# EAGLE design KMO_IO_MV6 (EAGLE 9.1.3)

## Sheet 1 of 2
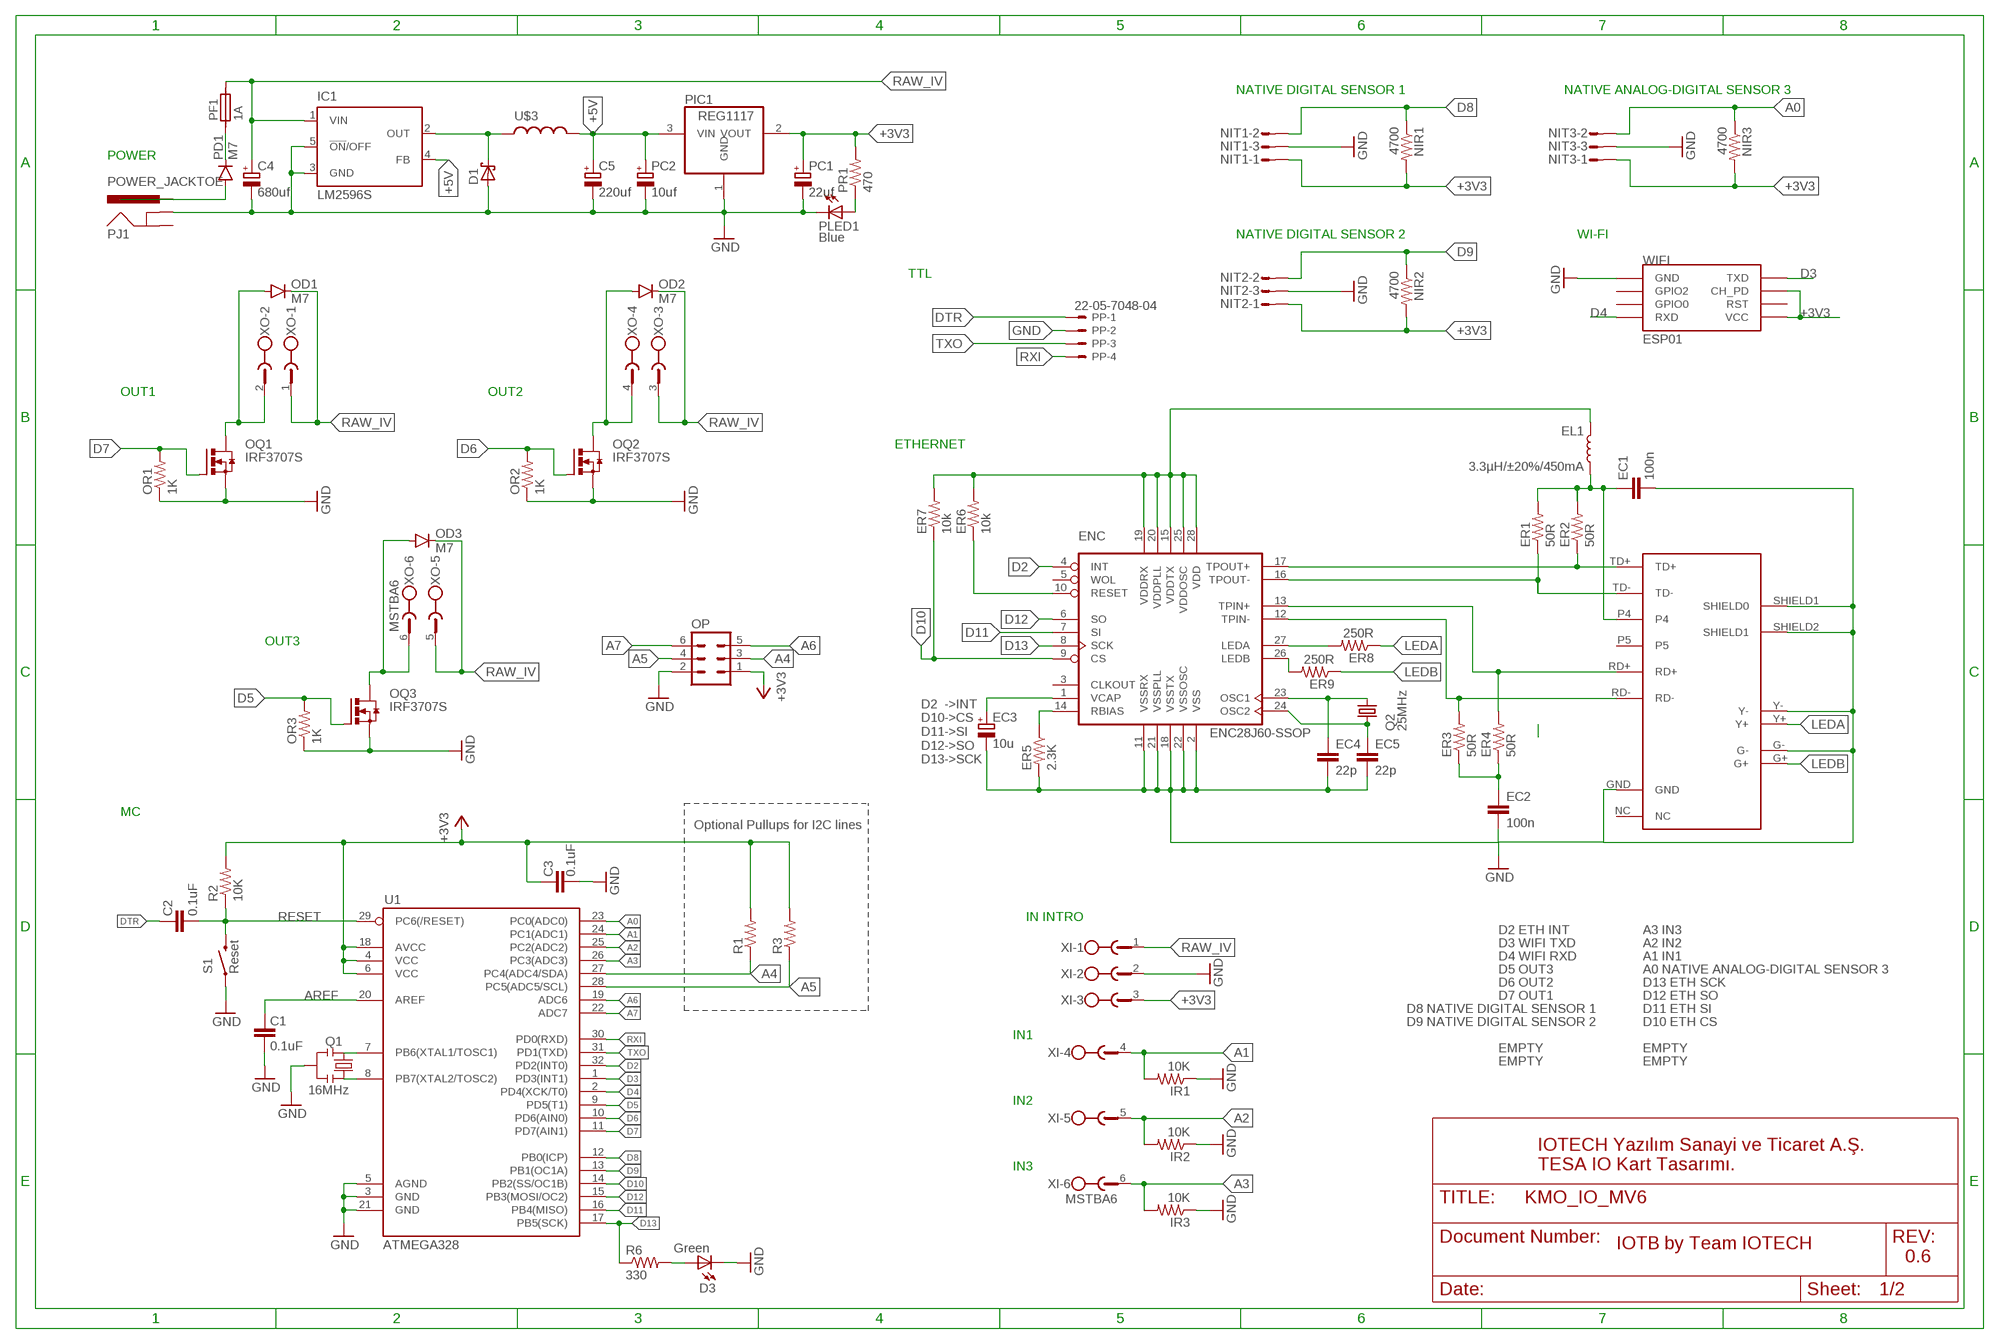
[diagram p0: schematic, sheet 1]

### Parts
C1  0.1uF  CAP0805  [0805]
C2  0.1uF  CAP0805  [0805]
C3  0.1uF  CAP0805  [0805]
C4  680uf  CPOL-EU140CLH-1010  [140CLH-1010]
C5  220uf  CPOL-EU140CLH-1010  [140CLH-1010]
D1  SCHOTTKY-DIODESMD  [SMB]
D3  Green  LEDCHIP-LED0805  [CHIP-LED0805]
EC1  100n  CAP0805  [0805]
EC2  100n  CAP0805  [0805]
EC3  10u  CPOL-EUCT3216  [CT3216]
EC4  22p  CAP0805  [0805]
EC5  22p  CAP0805  [0805]
EL1  3.3µH/±20%/450mA  INDUCTOR-0805-3.3UH  [0805]
ENC  ENC28J60-SSOP  [SSOP28]
ER1  50R  RESISTOR0805-RES  [0805]
ER2  50R  RESISTOR0805-RES  [0805]
ER3  50R  RESISTOR0805-RES  [0805]
ER4  50R  RESISTOR0805-RES  [0805]
ER5  2.3K  RESISTOR0805-RES  [0805]
ER6  10k  RESISTOR0805-RES  [0805]
ER7  10k  RESISTOR0805-RES  [0805]
ER8  250R  RESISTOR0805-RES  [0805]
ER9  250R  RESISTOR0805-RES  [0805]
IC1  LM2596S  [TO263-5]
IR1  10K  RESISTOR0805-RES  [0805]
IR2  10K  RESISTOR0805-RES  [0805]
IR3  10K  RESISTOR0805-RES  [0805]
NIR1  4700  RESISTOR0805-RES  [0805]
NIR2  4700  RESISTOR0805-RES  [0805]
NIR3  4700  RESISTOR0805-RES  [0805]
NIT1  S03P  [S03P]
NIT2  S03P  [S03P]
NIT3  S03P  [S03P]
OD1  M7  DIODESMA  [SMA-DIODE]
OD2  M7  DIODESMA  [SMA-DIODE]
OD3  M7  DIODESMA  [SMA-DIODE]
OP  MA03-2  [MA03-2]
OQ1  IRF3707S  IRF3704S  [D2PACK]
OQ2  IRF3707S  IRF3704S  [D2PACK]
OQ3  IRF3707S  IRF3704S  [D2PACK]
OR1  1K  RESISTOR0805-RES  [0805]
OR2  1K  RESISTOR0805-RES  [0805]
OR3  1K  RESISTOR0805-RES  [0805]
PC1  22uf  CPOL-EUCT3216  [CT3216]
PC2  10uf  CPOL-EUCT3216  [CT3216]
PD1  M7  DIODESMA  [SMA-DIODE]
PF1  1A  SIBA194600  [1820]
PIC1  REG1117  [SOT223]
PJ1  POWER_JACKTOE  [POWER_JACK_SMD_OVERPASTE_TOE]
PLED1  Blue  LEDCHIP-LED0805  [CHIP-LED0805]
PP  22-05-7048-04  [7395-04]
PR1  470  RESISTOR0805-RES  [0805]
Q1  16MHz  RESONATOR1:1  [RESONATOR-SMD-1:1]
Q2  25MHz  KX-9B  [5.0X3.2_2]
R1  RESISTOR0805-RES  [0805]
R2  10K  RESISTOR0805-RES  [0805]
R3  RESISTOR0805-RES  [0805]
R6  330  RESISTOR0805-RES  [0805]
S1  Reset  SWITCH-MOMENTARY-2SMD-ALT01  [TACTILE-SWITCH-SMD-ALT01]
U1  ATMEGA328  ATMEGA168  [TQFP32-08]
U$2  HR911105A  [RJ45]
U$3  MSS1260  [MSS1260]
WIFI  ESP01  [ESP01]
XI  MSTBA6  [MSTBA6]
XO  MSTBA6  [MSTBA6]

### Nets
+3V3: C3.2 EL1.1 ENC.15(VDDTX) ENC.19(VDDRX) ENC.20(VDDPLL) ENC.25(VDDOSC) ENC.28(VDD) ER6.2 ER7.2 NIR1.2 NIR2.2 NIR3.2 NIT1.1 NIT2.1 NIT3.1 OP.1 PC1.+ PIC1.2(VOUT) PR1.2 R1.2 R2.2 R3.2 U1.4(VCC) U1.6(VCC) U1.18(AVCC) WIFI.CH_PD WIFI.VCC XI.3
+5V: C5.+ IC1.4(FB) PC2.+ PIC1.3(VIN) U$3.P$1
A0: NIR3.1 NIT3.2 U1.23(PC0(ADC0))
A1: IR1.2 U1.24(PC1(ADC1)) XI.4
A2: IR2.2 U1.25(PC2(ADC2)) XI.5
A3: IR3.2 U1.26(PC3(ADC3)) XI.6
A4: OP.3 R1.1 U1.27(PC4(ADC4/SDA))
A5: OP.4 R3.1 U1.28(PC5(ADC5/SCL))
A6: OP.5 U1.19(ADC6)
A7: OP.6 U1.22(ADC7)
AREF: C1.2 U1.20(AREF)
D2: ENC.4(INT) U1.32(PD2(INT0))
D3: U1.1(PD3(INT1)) WIFI.TX(TXD)
D4: U1.2(PD4(XCK/T0)) WIFI.RX(RXD)
D5: OQ3.1(G) OR3.2 U1.9(PD5(T1))
D6: OQ2.1(G) OR2.2 U1.10(PD6(AIN0))
D7: OQ1.1(G) OR1.2 U1.11(PD7(AIN1))
D8: NIR1.1 NIT1.2 U1.12(PB0(ICP))
D9: NIR2.1 NIT2.2 U1.13(PB1(OC1A))
D10: ENC.9(CS) ER7.1 U1.14(PB2(SS/OC1B))
D11: ENC.7(SI) U1.16(PB4(MISO))
D12: ENC.6(SO) U1.15(PB3(MOSI/OC2))
D13: ENC.8(SCK) R6.1 U1.17(PB5(SCK))
DTR: C2.2 PP.1
EP4: EC1.1 EL1.2 ER1.2 ER2.2 U$2.P4
GND: C1.1 C3.1 C4.- C5.- D1.A D3.C EC1.2 EC2.2 EC3.- EC4.2 EC5.2 ENC.2(VSS) ENC.11(VSSRX) ENC.18(VSSTX) ENC.21(VSSPLL) ENC.22(VSSOSC) ER5.2 IC1.3(GND) IC1.5(!ON!/OFF) IR1.1 IR2.1 IR3.1 NIT1.3 NIT2.3 NIT3.3 OP.2 OQ1.3(S) OQ2.3(S) OQ3.3(S) OR1.1 OR2.1 OR3.1 PC1.- PC2.- PIC1.1(GND) PJ1.GND(GNDBREAK) PLED1.C PP.2 Q1.2 S1.1 S1.2 U1.3(GND) U1.5(AGND) U1.21(GND) U$2.G- U$2.GND U$2.SHIELD1(SHIELD0) U$2.SHIELD2(SHIELD1) U$2.Y- WIFI.GND XI.2
LEDA: ER8.1 U$2.Y+
LEDB: ER9.1 U$2.G+
N$1: OD3.A OQ3.2(D) XO.6
N$2: PD1.C PF1.1
N$3: OD1.A OQ1.2(D) XO.2
N$4: OD2.A OQ2.2(D) XO.4
N$5: D3.A R6.2
N$6: EC2.1 ER3.1 ER4.1
N$9: ENC.27(LEDA) ER8.2
N$10: Q1.3 U1.8(PB7(XTAL2/TOSC2))
N$11: PLED1.A PR1.1
N$13: EC3.+ ENC.1(VCAP)
N$14: ENC.26(LEDB) ER9.2
N$15: Q1.1 U1.7(PB6(XTAL1/TOSC1))
N$16: D1.C IC1.2(OUT) U$3.P$2
N$17: ENC.10(RESET) ER6.1
N$18: PD1.A PJ1.VIN0(PWR)
N$19: ENC.14(RBIAS) ER5.1
N$22: EC5.1 ENC.24(OSC2) Q2.1
N$24: EC4.1 ENC.23(OSC1) Q2.2
RAW_IV [vcc]: C4.+ IC1.1(VIN) OD1.C OD2.C OD3.C PF1.2 XI.1 XO.1 XO.3 XO.5
RD+: ENC.13(TPIN+) ER4.2 U$2.RD+
RD-: ENC.12(TPIN-) ER3.2 U$2.RD-
RESET: C2.1 R2.1 S1.3 S1.4 U1.29(PC6(/RESET))
RXI: PP.4 U1.30(PD0(RXD))
TD+: ENC.17(TPOUT+) ER2.1 U$2.TD+
TD-: ENC.16(TPOUT-) ER1.1 U$2.TD-
TXO: PP.3 U1.31(PD1(TXD))
Unconnected: ENC.3(CLKOUT) ENC.5(WOL) PJ1.P$4(GND) U$2.NC U$2.P5 WIFI.GPIO0 WIFI.GPIO2 WIFI.RST

### Notes on the sheet
- NATIVE DIGITAL SENSOR 1 | NATIVE ANALOG-DIGITAL SENSOR 3
- POWER
- NATIVE DIGITAL SENSOR 2 | WI-FI
- TTL
- OUT1 | OUT2
- ETHERNET
- OUT3
- D2  ->INT
  D10->CS
  D11->SI
  D12->SO
  D13->SCK
- MC
- Optional Pullups for I2C lines
- IN INTRO
- D2 ETH INT | A3 IN3
- D3 WIFI TXD | A2 IN2
- D4 WIFI RXD | A1 IN1
- D5 OUT3 | A0 NATIVE ANALOG-DIGITAL SENSOR 3
- D6 OUT2 | D13 ETH SCK
- D7 OUT1 | D12 ETH SO
- D8 NATIVE DIGITAL SENSOR 1 | D11 ETH SI
- D9 NATIVE DIGITAL SENSOR 2 | D10 ETH CS
- IN1
- EMPTY | EMPTY
- EMPTY | EMPTY
- IN2
- IN3
- IOTECH Yazılım Sanayi ve Ticaret A.Ş.
  TESA IO Kart Tasarımı.
- IOTB by Team IOTECH
- 0.6

## Sheet 2 of 2
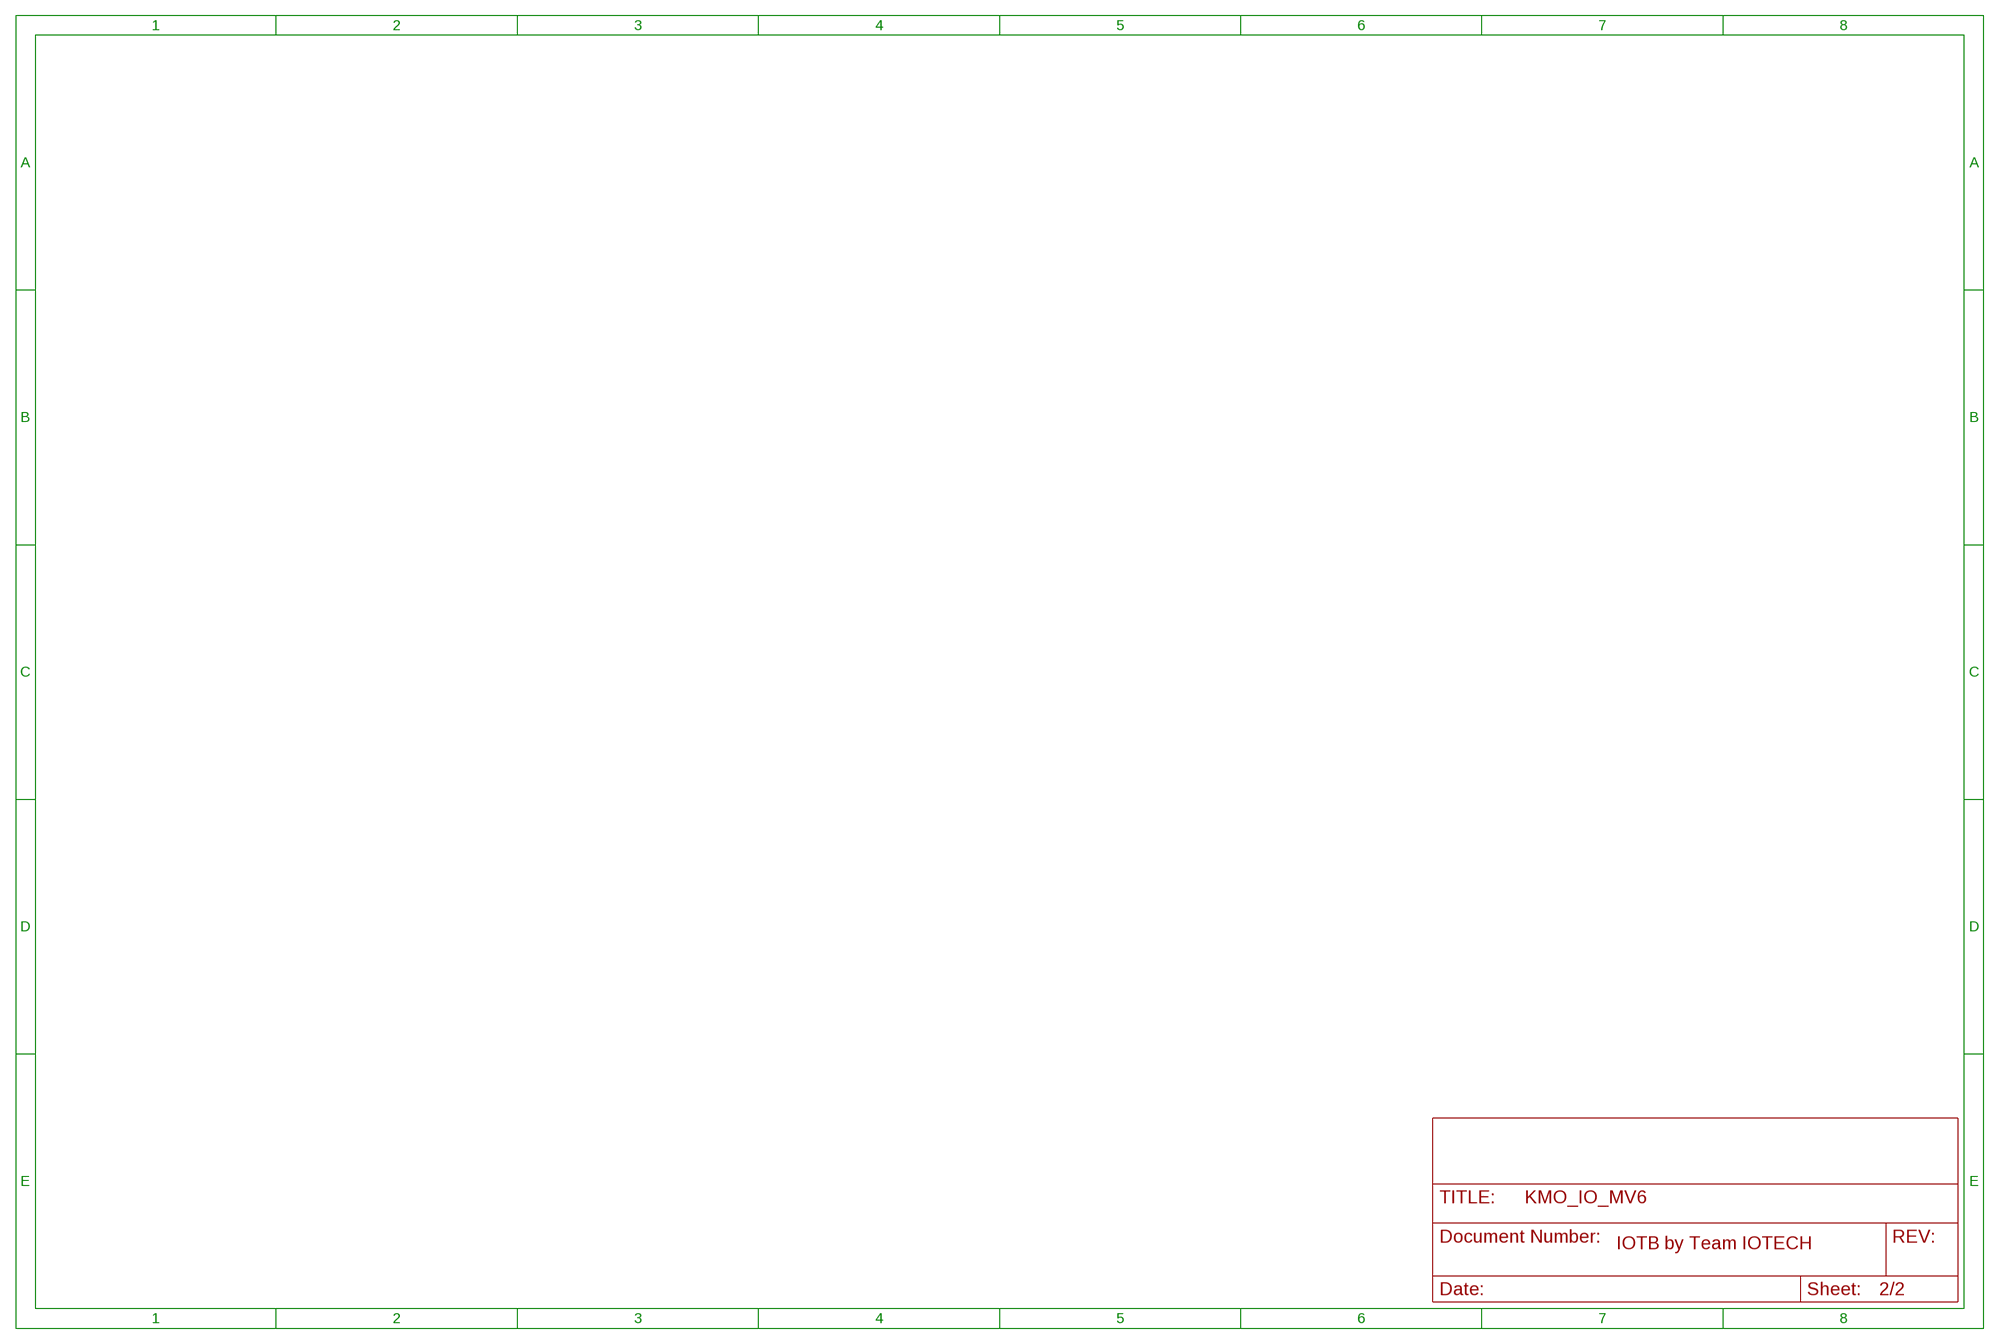
[diagram p1: schematic, sheet 2]

### Notes on the sheet
- IOTB by Team IOTECH

## Library data of the parts
C1-C3 EC1 EC2 EC4 EC5 = SparkFun-Passives:CAP: Capacitor Standard 0603 ceramic capacitor, and 0.1" leaded capacitor.
C4 C5 EC3 PC1 PC2 = rcl:CPOL-EU: POLARIZED CAPACITOR, European symbol; SPICEPREFIX: C
D1 = diode:SCHOTTKY-DIODE: Schottky Diode
D3 PLED1 = led:LED: LED OSRAM: - CHIPLED LG R971, LG N971, LY N971, LG Q971, LY Q971, LO R971, LY R971 LH N974, LH R974 LS Q976, LO Q976, LY Q976 LO Q996 - Hyper CHIPLED LW Q18S LB Q993, LB Q99A, LB R99A - SideLED LS A670, LO A670, LY A670, LG A670, LP A670 LB A673, LV A673, LT A673, LW A673 LH A674 LY A675 LS A676, LA A676, LO A676, LY A676, LW A676 LS A679, LY A679, LG A679 - Hyper Micro SIDELED® LS Y876, LA Y876, LO Y876, LY Y876 LT Y87S - SmartLED LW L88C, LW L88S LB L89C, LB L89S, LG L890 LS L89K, LO L89K, LY L89K LS L896, LA L896, LO L896, LY L896 - TOPLED LS T670, LO T670, LY T670, LG T670, LP T670 LSG T670, LSP T670, LSY T670, LOP T670, LYG T670 LG T671, LOG T671, LSG T671 LB T673, LV T673, LT T673, LW T673 LH T674 LS T676, LA T676, LO T676, LY T676, LB T676, LH T676, LSB T676, LW T676 LB T67C, LV T67C, LT T67C, LS T67K, LO T67K, LY T67K, LW E67C LS E67B, LA E67B, LO E67B, LY E67B, LB E67C, LV E67C, LT E67C LW T67C LS T679, LY T679, LG T679 LS T770, LO T770, LY T770, LG T770, LP T770 LB T773, LV T773, LT T773, LW T773 LH T774 LS E675, LA E675, LY E675, LS T675 LS T776, LA T776, LO T776, LY T776, LB T776 LHGB T686 LT T68C, LB T68C - Hyper Mini TOPLED® LB M676 - Mini TOPLED Santana® LG M470 LS M47K, LO M47K, LY M47K Source: http://www.osram.convergy.de LUXEON: - LUMILED® LXK2-PW12-R00, LXK2-PW12-S00, LXK2-PW14-U00, LXK2-PW14-V00 LXK2-PM12-R00, LXK2-PM12-S00, LXK2-PM14-U00 LXK2-PE12-Q00, LXK2-PE12-R00, LXK2-PE12-S00, LXK2-PE14-T00, LXK2-PE14-U00 LXK2-PB12-K00, LXK2-PB12-L00, LXK2-PB12-M00, LXK2-PB14-N00, LXK2-PB14-P00, LXK2-PB14-Q00 LXK2-PR12-L00, LXK2-PR12-M00, LXK2-PR14-Q00, LXK2-PR14-R00 LXK2-PD12-Q00, LXK2-PD12-R00, LXK2-PD12-S00 LXK2-PH12-R00, LXK2-PH12-S00 LXK2-PL12-P00, LXK2-PL12-Q00, LXK2-PL12-R00 Source: www.luxeon.com KINGBRIGHT: KA-3528ASYC Source: www.kingbright.com
EL1 = SparkFun-Coils:INDUCTOR: Inductors Resist changes in electrical current. Basically a coil of wire. SparkFun Products: SparkFun Load Cell Amplifier - HX711 <https://www.sparkfun.com/products/13879> IOIO-OTG - V2.2 <https://www.sparkfun.com/products/13613>; PROD_ID: NDUC-13076
ENC = microchip-enc28j60:ENC28J60-*: Microchip 10Mbit Eth. contoller with SPI interface
ER1-ER9 IR1-IR3 NIR1-NIR3 OR1-OR3 PR1 R1-R3 R6 = SparkFun-Passives:RESISTOR: Resistor Basic schematic elements and footprints for 0603, 1206, and PTH resistors.
IC1 = national-semiconductor:LM2596: SIMPLE SWITCHER® Power Converter 150 kHz 3A Step-Down Voltage Regulator Source: http://www.national.com/ds/LM/LM2596.pdf; MF: NATIONAL SEMICONDUCTOR; MPN: LM2596S-ADJ/NOPB; OC_FARNELL: 9494367; OC_NEWARK: 41K3842
NIT1-NIT3 = con-amp-mt:S03P: AMP MT CONNECTOR; OC_FARNELL: unknown; OC_NEWARK: unknown
OD1-OD3 PD1 = SparkFun-DiscreteSemi:DIODE: Diode These are standard reverse protection diodes and small signal diodes. SMA package can handle up to about 1A. SOD-323 can handle about 200mA. What the SOD-323 package when ordering, there are some mfgs out there that are 5-pin packages.
OP = con-lstb:MA03-2: PIN HEADER; OC_FARNELL: unknown; OC_NEWARK: unknown
OQ1-OQ3 = transistor-power:IRF3704: SMPS MOSFET HEXFET® Power MOSFET Source: http://www.irf.com/product-info/datasheets/data/irf3704.pdf
PF1 = _hhn_PtcFuses_Siba_r500_Ozan:SIBA194600*: SIBA PTC-Fuses, Series 194600, 1812 (4.5 3.2)mm Source: www.siba.de/ Package: SMD 1812 (4.5 x 3.2)mm Technologies: SIBA194600Axxx xxx: Trip-Current * 10 mA Author: Dipl.-Ing. FH Rainer Bayer
PIC1 = burr-brown:REG1117: 800mA and 1A Low Dropout (LDO) Positive Regulator 1.8V, 2.5V, 2.85V, 3.3V, 5V, and Adj; MPN: REG1117; OC_FARNELL: 1097566; OC_NEWARK: 14P6981
PJ1 = SparkFun-Connectors:POWER_JACK: Power Jack Connector This is the standard 5.5mm barrel jack for power. The PTH is the most common, proven, reliable, footprint. The Slot footprint only works if the mill layer is transmitted to the PCB fab house so be warned. Here are the connectors we sell at SparkFun: DC Barrel Power Jack/Connector <https://www.sparkfun.com/products/119> (PRT-00119) DC Barrel Power Jack/Connector (SMD) <https://www.sparkfun.com/products/12748> (PRT-12748) DC Barrel Jack Adapter - Breadboard Compatible <https://www.sparkfun.com/products/10811> (PRT-10811) It is used on this SparkFun product (and many, many others): SparkFun RedBoard - Programmed with Arduino <https://www.sparkfun.com/products/12757> (DEV-12757) Also, if you need a mating power supply or connector, please check these out: Wall Adapter Power Supply - 9VDC 650mA <https://www.sparkfun.com/products/298> (TOL-00298) DC Barrel Jack Adapter - Male <https://www.sparkfun.com/products/10287> (PRT-10287); PROD_ID: CONN-08106; SF_ID: PRT-12748
PP = con-molex:22-?-04: CONNECTOR wire to board 2.54 mm (.1 inch) pitch header; MF: MOLEX; OC_FARNELL: unknown; OC_NEWARK: unknown
Q1 = Testing:RESONATOR: Resonator Small SMD resonator. This is the itty bitty 10/20MHz resonators with built in caps. CSTCE10M0G55 and CSTCE20M0V53. Footprint for SMD has been used in SFE production for years, and does work okay. 1:1 is an attempt to get larger fillets on the sides so it will be easier to inspect these solders in our AOI machine. The pads have been minimized to match the actual metal under the resonator. To see this relation, it includes an image import of the bottom side of the component. Imported to scale on layer 200.
Q2 = crystal-geyer_V1_0:KX: Quartz Crystals (MHz) SMD: KX - Serie Model Size l/w/h [mm] Frequency Range Frequency Stability Temp. Range [°C] Load Capacitance AECQ 200 availabel Datasheet KX-4 KX-5 KX-6 KX-7 KX-9A KX-9B KX-12A KX-12B KX-13 KX-20 KX-K KX-KS 1.6/1.2/0.3 2.0/1.6/0.45 2.5/2.0/0.55 3.2/2.5/0.8 5.0/3.2/1.0 5.0/3.2/1.1 6.0/3.5/1.1 6.0/3.5/1.0 7.0/5.0 /1.3 11.6/5.5/1.6 12.3/4.5/4.2 12.3/4.5/3.2 24.0 ~ 80.0 MHz 16.0 ~ 80.0 MHz 12.0 ~ 80.0 MHz 8.0 ~ 60.0 MHz 7,68 ~ 300,0 MHz 8,0 ~ 50,0 MHz 8,0 ~ 150,0 MHz 8,0 ~ 50,0 MHz 6,0 ~ 160,0 MHz 3,579 ~ 25,0 MHz 3,579 ~ 70,0 MHz 3,579 ~ 70,0 MHz ±10 … ±50ppm ±10 … ±50ppm ±10 … ±50ppm ±10 … ±50ppm ±10 … ±50ppm ±10 … ±50ppm ±10 … ±50ppm ±10 … ±50ppm ±10 … ±50ppm ±50ppm ±10 … ±50ppm ±10 … ±50ppm (*) -40°C …+85°C (*) -40°C …+125°C (*) -40°C …+125°C (*) -40°C …+125°C (*) -40°C …+105°C (*) -40°C …+105°C (*) -40°C …+125°C (*) -40°C …+105°C (*) -40°C …+105°C (*) -40°C …+105°C (*) -40°C …+85°C (*) -40°C …+85°C 8, 8…16 8, 8…16 10, 8…16 12, 7…20 16, 10…20 16, 10…20 16, 10…20 16, 12…20 16, 12…20 16, 12…20 16, 12…30 16, 12…30 - yes yes yes - - - - - - - - KX-4.pdf <http://www.geyer-electronic.de/uploads/tx_userartikelfrequenz/GEYER-KX-4.pdf> KX-5.pdf <http://www.geyer-electronic.de/uploads/tx_userartikelfrequenz/GEYER-KX-5.pdf> KX-6.pdf <http://www.geyer-electronic.de/uploads/tx_userartikelfrequenz/GEYER-KX-6.pdf> KX-7.pdf <http://www.geyer-electronic.de/uploads/tx_userartikelfrequenz/GEYER-KX-7.pdf> KX-9A.pdf <http://www.geyer-electronic.de/uploads/tx_userartikelfrequenz/GEYER-KX-9A.pdf> KX-9B.pdf <http://www.geyer-electronic.de/uploads/tx_userartikelfrequenz/GEYER-KX-9B.pdf> KX-12A.pdf <http://www.geyer-electronic.de/uploads/tx_userartikelfrequenz/GEYER-KX-12A.pdf> KX-12B.pdf <http://www.geyer-electronic.de/uploads/tx_userartikelfrequenz/GEYER-KX-12B.pdf> KX-13.pdf <http://www.geyer-electronic.de/uploads/tx_userartikelfrequenz/GEYER-KX-13.pdf> KX-20.pdf <http://www.geyer-electronic.de/uploads/tx_userartikelfrequenz/GEYER-KX-20.pdf> KX-K.pdf <http://www.geyer-electronic.de/uploads/tx_userartikelfrequenz/GEYER-KX-K.pdf> KX-KS.pdf <http://www.geyer-electronic.de/uploads/tx_userartikelfrequenz/GEYER-KX-KS.pdf> <http://www.geyer-electronic.de/fileadmin/template/img/logo-geyer-electronic.png> Details see: http://www.geyer-electronic.de/Frequenz-Produkte.9.0.html Created 2016-06-07, Hans Locher 2016 (C) Geyer Quartz Technology KX4,KX5,KX6,KX7,KX9A,KX9B,KX12A,KX12B,KX13,KX20,KXK,KXKS;1612;2016;2520;3225;5032;6035;7050;11655;12345;1,6x1,2;2,0x1,6;2,5x2,0;3,2x2,5;5,0x3,2;6,0x3,5;7,0x5,0;11,6x5,5;12,3x4,5;12,3x4,5;1.6x1.2;2.0x1.6;2.5x2.0;3.2x2.5;5.0x3.2;6.0x3.5;7.0x5.0;11.6x5.5;12.3x4.5;12.3x4.5;
S1 = Testing:SWITCH-MOMENTARY-2: Various NO switches- pushbuttons, reed, etc
U1 = SparkFun:ATMEGA168
U$2 = HR911105A:HR911105A
U$3 = inductor-coilcraft:MSS1260: SMT Power Inductor
WIFI = esp8266modules:ESP01: ESP8266 Wifi module 01
XI XO = con-phoenix-508:MSTBA6: PHOENIX; MF: FARNELL; MPN: 1757284; OC_FARNELL: 3705213; OC_NEWARK: 71C4165

## Net classes
0 default: width 0.203 mm, drill 0.3 mm, clearance 0.16 mm
1 vcc: width 0.254 mm, drill 0.3 mm, clearance 0.16 mm

## Board
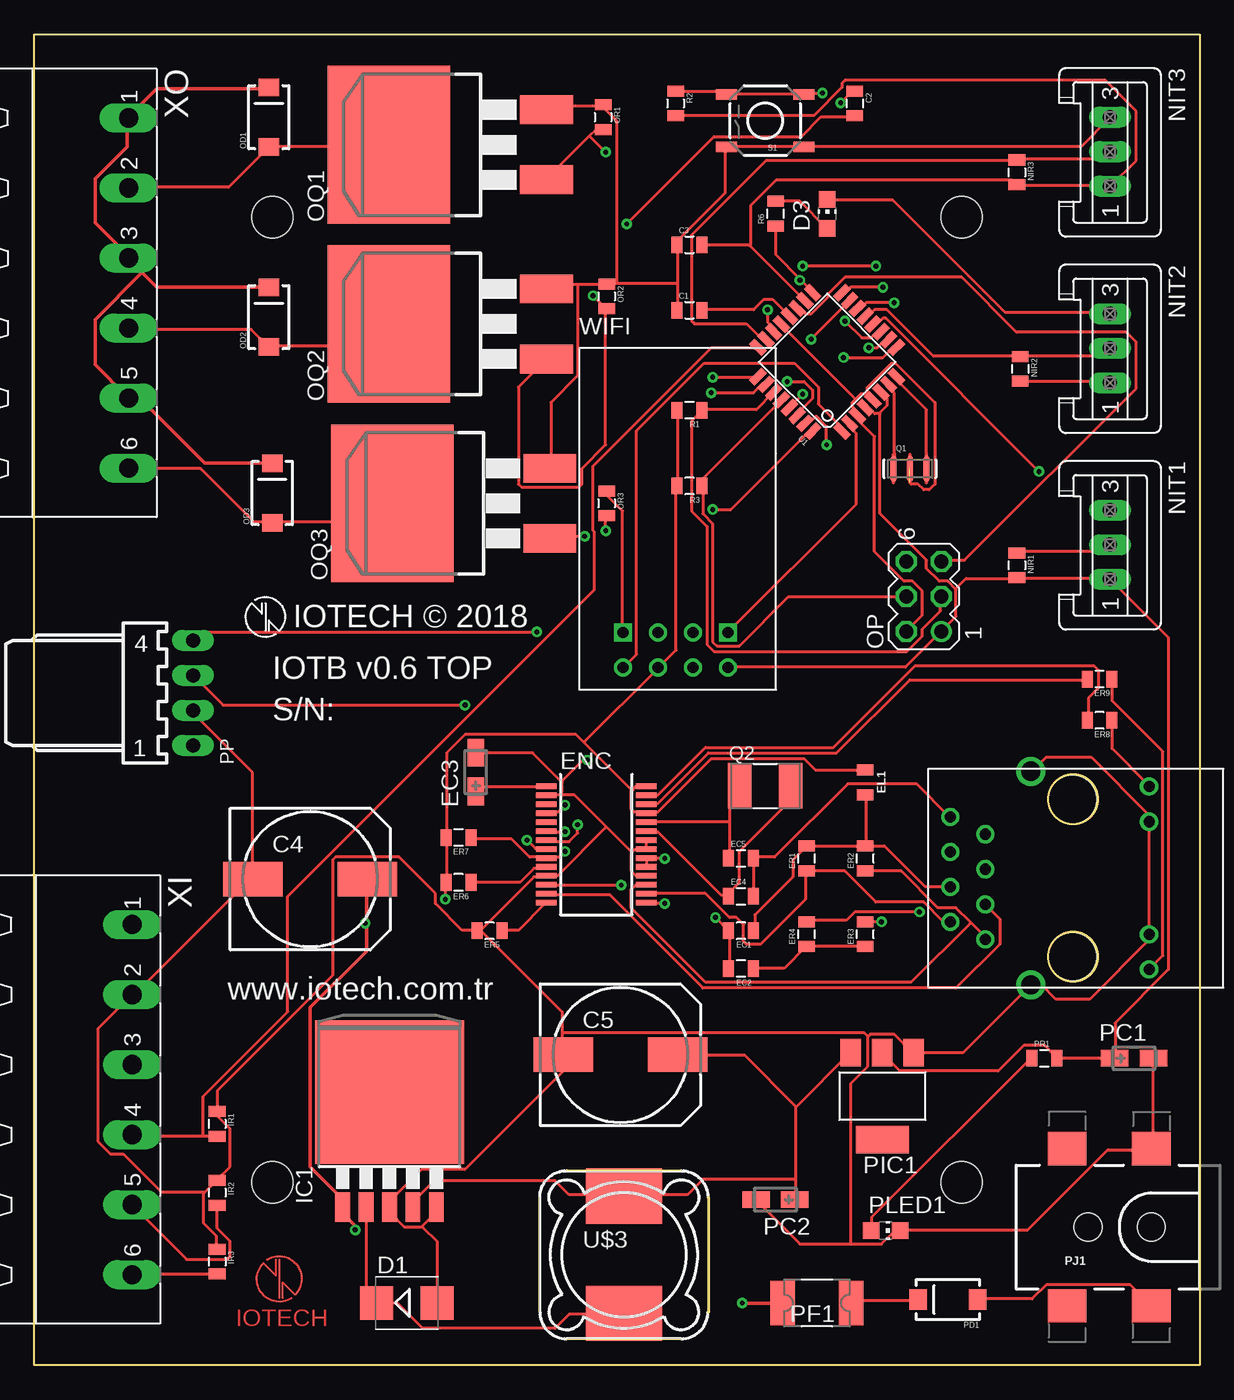
[diagram p2: board, top side]
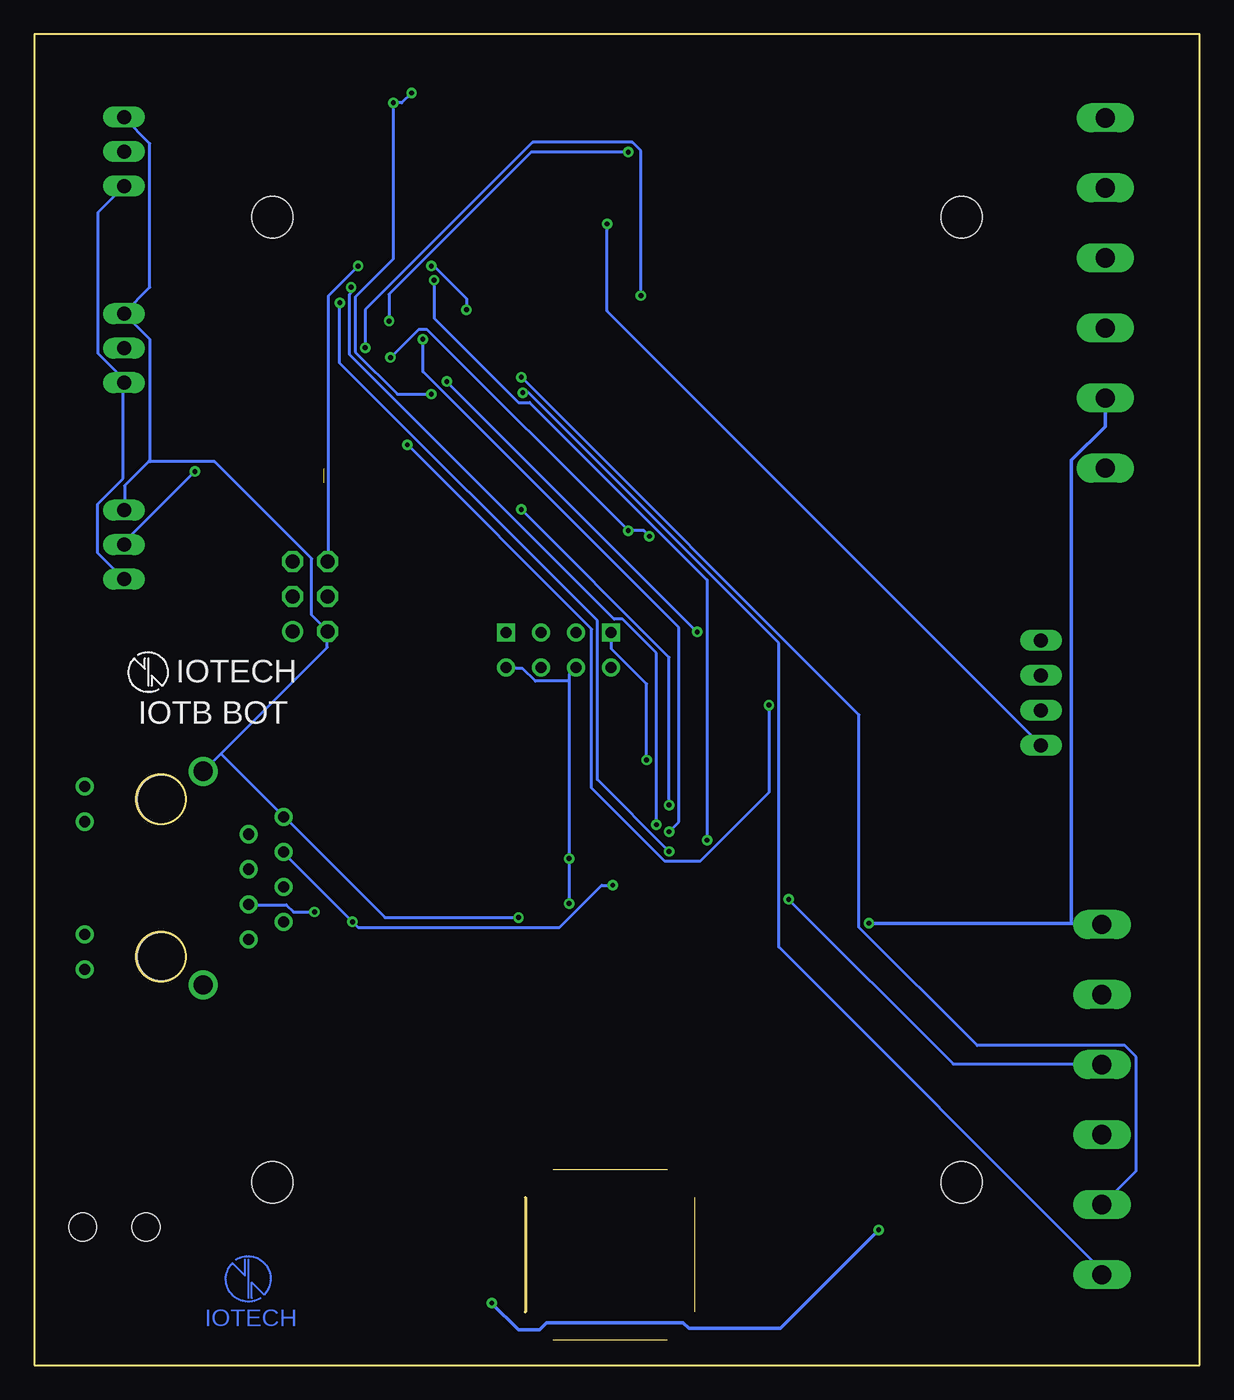
[diagram p3: board, bottom side, seen from below]

Size 84.5 x 96.5 mm. Coordinates in mm from the lower left corner, seen from the top.
Outline: 0,0 0,96.5 84.5,96.5 84.5,0 0,0
Copper layers (1*16): Top 0.035mm / dielectric 1.5mm / Bottom 0.035mm
Design rules "KMO_IO_M": minimum track width 6mil, minimum drill 0.35mm, track to track 0.205mm, track to pad 0.205mm, pad to pad 0.205mm, via to via 0.205mm, smd to smd 6mil, copper to edge 40mil, drill to drill 6mil, minimum pad ring 10mil, minimum via ring 8mil, stop-mask expansion 4mil, vias tented up to drill 0mil, thermal gap 10mil
Holes 3 mm at 17.25,83.25 67.25,83.25 17.25,13.25 67.25,13.25

### Footprints (pad centres in the part's own frame; a part is rotated, then mirrored left to right if it is on the bottom)
0805 = smd 0.8 x 1.2: 1 -0.9,0; 2 0.9,0
140CLH-1010 = smd 4.3 x 2.5: + 4.15,0; - -4.15,0
SMB = smd 2.4 x 2.4: A 2.2,0; C -2.2,0
CHIP-LED0805 = smd 1.2 x 1.2: A 0,-1.05; C 0,1.05
CT3216 = smd 2 x 1.2: + -1.4,0; - 1.4,0
SSOP28 = smd 0.4 x 1.5: 1 -4.225,-3.625; 2 -3.575,-3.625; 3 -2.925,-3.625; 4 -2.275,-3.625; 5 -1.625,-3.625; 6 -0.975,-3.625; 7 -0.325,-3.625; 8 0.325,-3.625; 9 0.975,-3.625; 10 1.625,-3.625; 11 2.275,-3.625; 12 2.925,-3.625; 13 3.575,-3.625; 14 4.225,-3.625; 15 4.225,3.625; 16 3.575,3.625; 17 2.925,3.625; 18 2.275,3.625; 19 1.625,3.625; 20 0.975,3.625; 21 0.325,3.625; 22 -0.325,3.625; 23 -0.975,3.625; 24 -1.625,3.625; 25 -2.275,3.625; 26 -2.925,3.625; 27 -3.575,3.625; 28 -4.225,3.625
TO263-5 = smd 1.067 x 2.159: 1 -3.404,-5.791; 2 -1.702,-5.791; 3 0,-5.791; 4 1.702,-5.791; 5 3.404,-5.791 | smd 10.8 x 10.41: 6 0,2.54
S03P = drill 1.016 long: 1 2.5,0; 2 0,0; 3 -2.5,0
SMA-DIODE = smd 1.27 x 1.47: A -2.15,0; C 2.15,0
MA03-2 = drill 1.016: 1 -2.54,-1.27 | drill 1.016 octagon: 2 -2.54,1.27; 3 0,-1.27; 4 0,1.27; 5 2.54,-1.27; 6 2.54,1.27
D2PACK = smd 2.083 x 3.81: 1 -2.54,-8.89; 3 2.54,-8.89 | smd 11.43 x 8.89: 2 0,2.54
1820 = smd 1.78 x 3.2: 1 -2.49,0; 2 2.49,0
SOT223 = smd 1.499 x 2.007: 1 -2.261,-3.15; 2 0.025,-3.15; 3 2.311,-3.15 | smd 3.81 x 2.007: 4 0,3.15
POWER_JACK_SMD_OVERPASTE_TOE = smd 2.8 x 2.4: GND 0,-5.7; P$4 6.1,-5.7; VIN0 0,5.7; VIN1 6.1,5.7 | hole 2.032: 0,0; 4.572,0
7395-04 = drill 1.016 long: 1 3.81,0; 2 1.27,0; 3 -1.27,0; 4 -3.81,0
RESONATOR-SMD-1:1 = smd 0.45 x 1.905: 1 -1.2,0; 2 0,0; 3 1.2,0
5.0X3.2_2 = smd 1.7 x 3.3: 1 -1.85,0; 2 1.85,0
TACTILE-SWITCH-SMD-ALT01 = smd 1.524 x 0.762: 1 -2.794,1.905; 2 2.794,1.905; 3 -2.794,-1.905; 4 2.794,-1.905
TQFP32-08 = smd 1.27 x 0.559: 1 -4.293,2.8; 2 -4.293,2; 3 -4.293,1.2; 4 -4.293,0.4; 5 -4.293,-0.4; 6 -4.293,-1.2; 7 -4.293,-2; 8 -4.293,-2.8; 17 4.293,-2.8; 18 4.293,-2; 19 4.293,-1.2; 20 4.293,-0.4; 21 4.293,0.4; 22 4.293,1.2; 23 4.293,2; 24 4.293,2.8 | smd 0.559 x 1.27: 9 -2.8,-4.293; 10 -2,-4.293; 11 -1.2,-4.293; 12 -0.4,-4.293; 13 0.4,-4.293; 14 1.2,-4.293; 15 2,-4.293; 16 2.8,-4.293; 25 2.8,4.293; 26 2,4.293; 27 1.2,4.293; 28 0.4,4.293; 29 -0.4,4.293; 30 -1.2,4.293; 31 -2,4.293; 32 -2.8,4.293
RJ45 = drill 0.8: G+ 5.84,-6.305; G- 5.84,-3.765; GND -8.57,4.76; NC -6.03,3.5; P4 -8.57,-0.32; P5 -6.03,0.96; RD+ -6.03,-1.58; RD- -8.57,2.22; TD+ -6.03,-4.12; TD- -8.57,-2.86; Y+ 5.84,6.945; Y- 5.84,4.405 | drill 1.4: SHIELD1 -2.73,-7.425; SHIELD2 -2.73,8.065 | hole 3.5: 0.3,-5.38; 0.3,6.02
MSS1260 = smd 5.5 x 4: P$1 0,4.25; P$2 0,-4.25
ESP01 = drill 0.8: CH_PD -1.285,-8.178; GPIO0 1.255,-5.638; GPIO2 -1.285,-5.638; RST 1.255,-8.178; TX -3.825,-8.178; VCC 3.795,-8.178 | drill 0.8 square: GND -3.825,-5.638; RX 3.795,-5.638
MSTBA6 = drill 1.397 long: 1 -12.7,5.08; 2 -7.62,5.08; 3 -2.54,5.08; 4 2.54,5.08; 5 7.62,5.08; 6 12.7,5.08

### Placement (x,y rotation side)
C1  47.5,76.5 0 top
C2  59.5,91.5 270 top
C3  47.5,81.25 0 top
C4  20,35.25 0 top
C5  42.5,22.5 0 top
D1  27,4.5 0 top
D3  57.5,83.5 0 top
EC1  51.25,31.5 180 top
EC2  51.25,28.75 180 top
EC3  32,43 90 top
EC4  51.25,34 0 top
EC5  51.25,36.75 0 top
EL1  60.25,42.25 270 top
ENC  40.75,37.75 270 top
ER1  56,36.75 90 top
ER2  60.25,36.75 90 top
ER3  60.25,31.25 90 top
ER4  56,31.25 90 top
ER5  33,31.5 180 top
ER6  30.75,35 180 top
ER7  30.75,38.25 180 top
ER8  77.25,46.75 180 top
ER9  77.25,49.75 180 top
IC1  25.75,17.25 0 top
IR1  13.25,17.5 270 top
IR2  13.25,12.5 270 top
IR3  13.25,7.5 270 top
NIR1  71.25,58 270 top
NIR2  71.5,72.25 270 top
NIR3  71.25,86.5 270 top
NIT1  78,59.5 270 top
NIT2  78,73.75 270 top
NIT3  78,88 270 top
OD1  17,90.5 90 top
OD2  17,76 90 top
OD3  17.25,63.25 90 top
OP  64.5,55.75 90 top
OQ1  28.25,88.5 90 top
OQ2  28.25,75.5 90 top
OQ3  28.5,62.5 90 top
OR1  41.25,90.5 270 top
OR2  41.5,77.5 270 top
OR3  41.5,62.5 270 top
PC1  79.75,22.25 0 top
PC2  53.75,12 180 top
PD1  66.25,4.75 180 top
PF1  56.75,4.5 180 top
PIC1  61.5,19.5 180 top
PJ1  81,10 180 top
PLED1  61.75,9.75 270 top
PP  11.5,48.75 270 top
PR1  73.25,22.25 0 top
Q1  63.5,65 0 top
Q2  53,42 0 top
R1  47.5,69.25 180 top
R2  46.5,91.5 270 top
R3  47.5,63.75 180 top
R6  53.75,83.5 90 top
S1  53,90.25 180 top
U1  57.5,72.75 135 top
U$1  [IOTECH_COPPER_W_TEXT]  17.75,6.25 0 top
U$2  75,35 0 top
U$3  42.75,8 0 top
U$4  [IOTECH_COPPER_W_TEXT]  69,6.25 0 bottom
WIFI  46.5,58.75 0 top
XI  2,19.25 270 top
XO  1.75,77.75 270 top

### Tracks (layer width: path | path; a pad name or v marks a point on that pad's centre or on a via)
+3V3  (via drill 0.35)
  Top 0.203: R1.2 46.64,69.19 46.64,63.78 R3.2 46.53,63.68 46.53,51.84 45.31,50.62 WIFI.CH_PD 45.21,50.52 39.9,45.21 39.85,45.16 | ENC.19 44.39,36.13 44.39,36.74 ENC.20 44.49,36.74 v45.72,36.74 | v45.72,33.47 44.39,33.47 ENC.15 | EL1.1 60.21,43.17 56.64,43.17 55.82,43.98 49.09,43.98 45.21,40.11 44.39,40.11 ENC.25 44.29,40.11 43.47,40.11 43.27,40.31 43.27,41.64 43.32,41.69 | 43.32,41.69 43.58,41.94 44.29,41.94 ENC.28 | 39.85,45.16 43.27,41.74 43.32,41.69 | 39.85,45.16 39.29,45.72 31.23,45.72 29.9,44.39 29.9,38.27 ER7.2 29.9,38.17 29.9,35 ER6.2 29.8,34.9 v29.8,33.78 | 51.89,81.18 55.82,77.25 U1.18 | 51.89,81.18 51.84,81.23 48.47,81.23 C3.2 | NIR2.2 71.54,71.33 77.97,71.33 NIT2.1 | R2.2 46.53,90.62 56.54,90.62 58.58,92.66 58.58,92.97 58.78,93.17 77.66,93.17 79.91,90.93 79.91,87.36 78.07,85.52 NIT3.1 77.97,85.52 71.33,85.52 NIR3.2 71.23,85.62 70.92,85.93 53.78,85.93 51.94,84.09 51.94,81.23 51.89,81.18 | PIC1.2 61.54,22.55 62.76,21.33 69.9,21.33 71.74,23.16 73.27,23.16 74.09,22.35 PR1.2 74.19,22.25 78.27,22.25 PC1.+ 78.37,22.35 78.37,24.8 82.25,28.68 82.25,52.76 78.07,56.94 NIT1.1 77.97,57.05 71.33,57.05 NIR1.2 71.23,57.05 67.56,57.05 66.84,56.33 66.79,56.28 | 61.28,69.04 61.84,69.6 61.84,70.11 61.43,70.52 U1.6 | 61.28,69.04 61.23,68.99 60.92,68.99 60.52,69.39 60.31,69.39 U1.4 | 66.79,56.28 66.84,56.23 66.84,54.29 65.82,53.27 OP.1 65.72,53.17 63.17,50.62 50.31,50.62 WIFI.VCC | 66.79,56.28 66.23,56.84 65.62,56.84 64.7,57.76 64.7,58.37 61.33,61.74 61.33,68.99 61.28,69.04
  Bottom 0.203: 45.72,49.6 45.72,50.11 45.31,50.52 WIFI.CH_PD | 45.72,49.6 v45.72,36.74 v45.72,33.47 | 45.72,49.6 48.17,49.6 49.09,50.52 50.21,50.52 WIFI.VCC | v29.8,33.78 17.86,21.84 7.14,21.84 XI.3 | NIT3.1 78.07,85.42 79.91,83.58 79.91,73.37 78.07,71.54 78.07,71.33 NIT2.1 78.07,71.23 78.07,64.29 79.91,62.45 79.91,58.88 78.07,57.05 NIT1.1
+5V
  Top 0.203: IC1.4 27.55,11.53 27.55,11.94 28.98,13.37 37.76,13.37 38.78,12.35 42.66,12.35 U$3.P$1 42.76,12.35 47.35,12.35 48.47,13.47 55.21,13.47 | 55.21,13.47 55.21,18.68 55.26,18.73 | 55.21,13.47 55.21,12.04 PC2.+ | 55.26,18.73 59.09,22.55 PIC1.3 | C5.+ 46.74,22.45 51.53,22.45 55.21,18.78 55.26,18.73
A0
  Top 0.203: NIT3.2 77.97,87.97 77.46,87.46 71.33,87.46 NIR3.1 71.23,87.36 53.07,87.36 47.66,81.95 47.66,75.72 47.86,75.52 51.64,75.52 52.76,74.39 52.96,74.39 U1.23
A1
  Top 0.203: 12.25,16.63 7.14,16.63 XI.4 | 12.25,16.63 13.16,16.63 IR1.2 | 12.25,16.63 12.25,19.49 18.37,25.61 18.37,33.98 40.62,56.23 40.62,60.41 40.51,60.52 40.51,65.21 49.09,73.78 52.45,73.78 U1.24
A2  (via drill 0.35)
  Top 0.203: IR2.2 13.27,11.53 13.27,9.9 14.19,8.98 14.19,7.86 13.98,7.65 11.02,7.65 7.14,11.53 XI.5 | v49.19,71.64 52.45,71.64 U1.25
  Bottom 0.203: v49.19,71.64 24.7,47.15 24.7,31.74 16.12,23.16 5.41,23.16 4.59,22.35 4.59,14.08 7.04,11.63 XI.5
A3  (via drill 0.35)
  Top 0.203: IR3.2 13.16,6.63 7.14,6.63 XI.6 | v49.09,70.52 52.15,70.52 52.76,71.13 52.96,71.13 U1.26
  Bottom 0.203: v49.09,70.52 48.68,70.52 30.51,52.35 30.51,30.31 7.14,6.94 7.14,6.63 XI.6
A4
  Top 0.203: U1.27 53.58,70.52 52.35,69.29 48.47,69.29 R1.1 48.37,69.19 47.66,68.48 47.66,61.94 48.78,60.82 48.78,52.25 49.29,51.74 63.27,51.74 64.39,52.86 64.39,53.37 65.72,54.7 65.72,55.72 OP.3
A5
  Top 0.203: U1.28 54.09,69.9 48.47,64.29 48.47,63.78 R3.1 48.47,63.68 48.47,61.74 49.19,61.03 49.19,52.45 49.49,52.15 51.13,52.15 54.7,55.72 63.17,55.72 OP.4
A6
  Top 0.203: U1.19 55.41,76.54 55.62,76.54 55.92,76.23 56.33,76.23 57.56,77.46 57.56,77.66 58.78,78.89 67.25,78.89 71.23,74.91 79.19,74.91 79.91,74.19 79.91,70.82 67.45,58.37 65.82,58.37 OP.5
A7  (via drill 0.35)
  Top 0.203: v53.17,76.54 53.17,75.62 53.58,75.21 53.58,75.01 U1.22 | v61.03,79.7 v55.72,79.7
  Bottom 0.203: v53.17,76.54 53.17,77.35 55.52,79.7 v55.72,79.7 | v61.03,79.7 63.17,77.56 63.17,58.37 OP.6
AREF
  Top 0.203: C1.2 48.47,76.54 52.15,76.54 52.86,77.25 53.58,77.25 54.7,76.13 U1.20
D2  (via drill 0.35)
  Top 0.203: v49.19,62.05 50.52,62.05 56.13,67.66 56.43,67.66 U1.32 | v38.47,40.62 37.96,40.11 37.15,40.11 ENC.4
  Bottom 0.203: v49.19,62.05 38.47,51.33 v38.47,40.62
D3
  Top 0.203: U1.1 58.48,67.76 58.48,68.07 56.84,69.7 56.84,70.92 55.11,72.66 48.58,72.66 43.68,67.76 43.68,51.53 42.76,50.62 WIFI.TX
D4
  Top 0.203: U1.2 59.19,68.27 59.19,67.97 59.6,67.56 59.6,62.45 50.31,53.17 WIFI.RX
D5  (via drill 0.35)
  Top 0.203: v41.43,60.52 41.43,61.54 OR3.2 | v39.9,60.11 37.55,60.11 37.45,60.01 OQ3.1 | v58.68,73.07 61.54,73.07 62.25,73.78 62.45,73.78 U1.9
  Bottom 0.203: v39.9,60.11 40.31,60.52 v41.43,60.52 56.02,75.11 56.64,75.11 v58.68,73.07
D6  (via drill 0.35)
  Top 0.203: OQ2.1 37.04,72.86 35.1,70.92 35.1,63.88 35.31,63.68 39.49,63.68 39.7,63.88 39.7,65.01 41.43,66.74 41.43,76.54 OR2.2 41.43,76.64 v40.51,77.56 | v60.52,73.78 61.13,73.78 61.64,74.29 61.94,74.29 U1.10
  Bottom 0.203: v60.52,73.78 60.52,76.54 48.37,88.68 41.13,88.68 40.51,88.07 v40.51,77.56
D7  (via drill 0.35)
  Top 0.203: 40.26,89.14 37.15,86.03 OQ1.1 | 40.26,89.14 40.72,89.6 41.23,89.6 OR1.2 | v58.78,75.72 60.01,74.5 60.72,74.5 61.13,74.91 61.33,74.91 U1.11 | v41.43,87.97 40.31,89.09 40.26,89.14
  Bottom 0.203: v58.78,75.72 58.78,77.66 48.47,87.97 v41.43,87.97
D8  (via drill 0.35)
  Top 0.203: NIR1.1 71.33,58.98 77.46,58.98 77.97,59.49 NIT1.2 | v72.86,64.8 61.74,75.92 61.54,75.92 61.13,75.52 60.82,75.52 U1.12
  Bottom 0.203: v72.86,64.8 78.07,59.6 NIT1.2
D9
  Top 0.203: NIT2.2 77.97,73.68 77.46,73.17 71.54,73.17 NIR2.1 71.44,73.17 65.21,73.17 61.84,76.54 60.92,76.54 60.52,76.13 60.31,76.13 U1.13
D10  (via drill 0.35)
  Top 0.203: ER7.1 31.74,38.17 34.59,38.17 35.92,36.84 37.04,36.84 ENC.9 37.15,36.84 38.06,36.84 v38.47,37.25 | v62.35,77.05 60.31,77.05 59.9,76.64 U1.14
  Bottom 0.203: v62.35,77.05 62.35,72.66 43.68,53.98 43.68,42.45 v38.47,37.25
D11  (via drill 0.35)
  Top 0.203: v61.54,78.17 59.19,78.17 58.88,77.86 58.58,77.86 U1.16 | v39.39,39.19 39.39,38.58 38.78,37.96 37.25,37.96 37.15,38.06 ENC.7
  Bottom 0.203: v61.54,78.17 61.54,77.76 61.64,77.66 61.64,73.27 42.45,54.09 41.84,54.09 39.39,51.64 v39.39,39.19
D12  (via drill 0.35)
  Top 0.203: v56.33,74.39 59.09,77.15 U1.15 | v38.47,38.68 37.15,38.68 ENC.6
  Bottom 0.203: v56.33,74.39 56.33,72.05 37.76,53.47 37.76,39.39 v38.47,38.68
D13  (via drill 0.35)
  Top 0.203: 55.57,78.73 56.43,77.86 U1.17 | 55.57,78.73 53.78,80.52 53.78,82.56 R6.1 | v35.72,38.06 36.33,37.45 37.04,37.45 ENC.8 | v55.52,78.68 55.57,78.73
  Bottom 0.203: v35.72,38.06 35.72,56.94 48.58,69.8 49.39,69.8 55.52,75.92 v55.52,78.68
DTR  (via drill 0.35)
  Top 0.203: v42.96,82.76 49.29,89.09 55.62,89.09 57.05,90.52 59.49,90.52 C2.2
  Bottom 0.203: v42.96,82.76 42.96,76.44 11.53,45 PP.1
EP4
  Top 0.203: ER2.2 60.31,37.66 60.31,41.33 EL1.2 | EC1.1 52.25,31.53 52.25,32.66 55.01,35.41 55.01,36.64 55.92,37.55 ER1.2 56.02,37.66 60.21,37.66 ER2.2 | U$2.P4 66.33,34.7 64.6,34.7 61.64,37.66 60.41,37.66 ER2.2
GND  (via drill 0.35)  (1 unrouted)
  Top 0.203: 12.3,12.5 13.16,13.37 IR2.1 13.27,13.47 14.19,14.39 14.19,17.14 13.27,18.06 13.27,18.37 IR1.1 13.27,18.47 13.27,19.9 21.64,28.27 21.64,36.64 21.84,36.84 26.43,36.84 29.08,34.19 29.08,33.47 31.02,31.53 32.04,31.53 ER5.2 | 12.3,12.5 12.25,12.45 12.25,10.31 13.16,9.39 13.16,8.47 IR3.1 | PP.2 11.53,47.45 11.53,47.25 15.82,42.96 15.82,35.31 C4.- 15.72,35.31 7.35,26.94 7.14,26.94 XI.2 7.04,26.84 4.59,24.39 4.59,16.23 5.51,15.31 6.43,15.31 9.18,12.55 12.25,12.55 12.3,12.5 | OR3.1 41.53,63.37 41.53,63.07 42.66,61.94 42.66,53.17 WIFI.GND | 43.32,37.2 43.47,37.35 44.29,37.35 ENC.21 44.39,37.45 44.39,38.06 ENC.22 | 43.32,37.2 43.27,37.15 43.27,35.82 43.58,35.51 44.29,35.51 ENC.18 | 38.27,41.33 39.19,41.33 41.48,39.03 | 38.27,41.33 37.15,41.33 ENC.2 | 41.48,39.03 43.27,37.25 43.32,37.2 | 38.22,42.3 38.27,42.25 38.27,41.33 | 38.22,42.3 36.13,44.39 32.04,44.39 EC3.- | v40.11,43.88 39.8,43.88 38.27,42.35 38.22,42.3 | 28.11,10.05 29.08,11.02 29.08,11.43 IC1.5 | 28.11,10.05 28.06,10 26.84,10 25.82,11.02 25.82,11.43 IC1.3 25.82,11.53 25.82,11.94 28.06,14.19 31.23,14.19 38.27,21.23 38.27,22.45 C5.- 38.27,22.55 38.27,24.08 | D1.A 29.19,4.59 29.19,8.98 28.17,10 28.11,10.05 | 32.35,31.53 32.15,31.53 ER5.2 | 32.35,31.53 36.23,35.41 37.04,35.41 ENC.11 37.15,35.51 37.96,35.51 41.43,38.98 41.48,39.03 | 38.27,24.08 38.27,25.61 32.35,31.53 | 32.35,31.53 ER5.2 | OQ1.3 37.15,91.13 37.35,91.33 41.23,91.33 OR1.1 41.23,91.23 42.25,90.21 42.25,78.48 | 46.64,78.48 46.64,81.23 C3.1 46.64,81.33 46.64,81.54 50.11,85.01 50.11,88.27 S1.2 50.21,88.38 55.72,88.38 S1.1 55.82,88.38 75.92,88.38 77.97,90.42 NIT3.3
  Top 0.203: 46.64,78.48 46.64,76.54 C1.1 | 39.39,78.37 37.45,78.37 37.15,78.07 OQ2.3 | 39.39,78.37 41.43,78.37 OR2.1 41.53,78.48 42.25,78.48 | 42.25,78.48 46.64,78.48 | 39.39,78.37 39.39,71.74 37.45,69.8 37.45,65.11 OQ3.3 | D3.C 57.56,84.5 62.25,84.5 70.42,76.33 77.97,76.33 NIT2.3 | PC1.- 81.13,22.25 81.13,15.82 81.03,15.72 PJ1.GND 80.93,15.61 77.86,15.61 72.05,9.8 62.86,9.8 PLED1.C 62.76,9.7 62.35,9.7 61.43,8.78 59.19,8.78 | 59.19,8.78 55.52,8.78 52.35,11.94 PC2.- | EC4.2 52.15,34.09 52.15,36.74 EC5.2 52.25,36.84 53.68,36.84 58.98,42.15 63.98,42.15 66.33,39.8 U$2.GND | EC2.2 50.41,28.78 50.41,31.43 EC1.2 50.31,31.53 v49.39,32.45 | 59.55,70.06 59.9,70.42 60.31,70.42 60.72,70.01 U1.5 60.41,70.42 60.41,70.92 62.15,72.66 62.45,72.66 65.31,69.8 65.31,63.88 64.9,63.48 64.5,63.48 64.09,63.88 63.58,63.88 63.5,63.98 | 59.55,70.06 59.29,69.8 59.29,69.5 59.6,69.19 59.6,68.88 U1.3 59.7,68.78 59.7,68.58 60.92,67.35 60.92,58.98 63.07,56.84 63.68,56.84 64.39,56.13 64.39,54.39 63.27,53.27 OP.2 | U1.21 54.19,75.42 59.49,70.11 59.55,70.06 | U$2.SHIELD2 72.35,43.06 73.37,44.09 76.64,44.09 80.82,39.9 80.82,39.49 U$2.Y- 80.82,39.39 80.82,31.33 U$2.G- 80.82,31.23 80.82,30.82 76.54,26.53 74.09,26.53 73.07,27.55 72.35,27.55 U$2.SHIELD1 72.25,27.55 67.35,22.66 63.78,22.66 PIC1.1 63.68,22.66 62.35,23.98 60.62,23.98 60.47,23.83 | 59.19,8.78 59.19,20.41 60.41,21.64 60.41,23.78 60.47,23.83 | 38.27,24.08 60.21,24.08 60.41,23.88 60.47,23.83
  Bottom 0.203: v40.11,43.88 40.11,49.39 42.66,51.94 42.66,53.07 WIFI.GND | 76.18,65.57 76.13,65.62 76.13,74.39 77.97,76.23 NIT2.3 77.97,76.33 76.13,78.17 76.13,88.58 77.97,90.42 NIT3.3 | 76.18,65.57 77.97,63.78 77.97,62.05 NIT1.3 | v49.39,32.45 59.09,32.45 66.33,39.7 U$2.GND 66.44,39.8 70.92,44.29 70.98,44.34 | 70.98,44.34 72.25,43.06 U$2.SHIELD2 | 70.98,44.34 63.27,52.05 63.27,53.17 OP.2 63.27,53.27 64.39,54.39 64.39,58.48 71.44,65.52 76.13,65.52 76.18,65.57
LEDA
  Top 0.203: ER8.1 78.17,46.74 78.17,44.7 80.82,42.05 U$2.Y+
LEDB
  Top 0.203: ER9.1 78.17,49.7 78.17,48.17 81.84,44.49 81.84,29.7 80.93,28.78 U$2.G+
N$1
  Top 0.203: OQ3.2 25.92,62.45 24.59,61.13 17.35,61.13 OD3.A 17.25,61.13 15.92,61.13 12.04,65.01 6.84,65.01 XO.6
N$2
  Top 0.203: PD1.C 64.09,4.69 59.39,4.69 59.29,4.59 PF1.1
N$3
  Top 0.203: OQ1.2 25.61,88.48 25.51,88.38 17.04,88.38 OD1.A 16.94,88.27 14.08,85.42 6.84,85.42 XO.2
N$4
  Top 0.203: OQ2.2 25.61,75.42 24.08,73.88 17.04,73.88 OD2.A 16.94,73.88 15.72,75.11 6.84,75.11 XO.4
N$5
  Top 0.203: R6.2 53.78,84.39 55.52,84.39 57.45,82.46 D3.A
N$6
  Top 0.203: EC2.1 52.25,28.78 54.39,28.78 55.92,30.31 ER4.1 56.02,30.41 60.21,30.41 ER3.1
N$9
  Top 0.203: ER8.2 76.44,46.84 76.44,48.37 77.15,49.09 77.15,50.41 76.84,50.72 63.88,50.72 57.96,44.8 48.68,44.8 45.21,41.33 44.39,41.33 ENC.27
N$10
  Top 0.203: U1.8 62.56,71.64 62.56,71.44 64.7,69.29 64.7,66.13 Q1.3
N$11
  Top 0.203: PLED1.A 60.72,9.8 60.72,10.71 72.25,22.25 PR1.1
N$13
  Top 0.203: ENC.1 37.04,41.94 32.35,41.94 32.04,41.64 EC3.+
N$14
  Top 0.203: ER9.2 76.33,49.7 63.48,49.7 58.17,44.39 48.88,44.39 45.21,40.72 44.39,40.72 ENC.26
N$15
  Top 0.203: U1.7 62.05,71.13 62.05,70.82 62.35,70.52 62.35,66.13 Q1.1
N$16
  Top 0.203: IC1.2 24.08,11.43 24.08,5.31 24.8,4.59 D1.C 24.9,4.49 26.33,4.49 28.17,2.65 37.76,2.65 38.78,3.67 42.66,3.67 U$3.P$2
N$17
  Top 0.203: ER6.1 31.74,35 35.21,35 36.23,36.02 37.04,36.02 ENC.10
N$18
  Top 0.203: PD1.A 68.48,4.8 72.35,4.8 73.37,5.82 79.5,5.82 80.93,4.39 PJ1.VIN0
N$19
  Top 0.203: ER5.1 33.98,31.53 35.1,31.53 37.04,33.47 ENC.14
N$22
  Top 0.203: 50.41,39.39 50.41,41.23 51.13,41.94 Q2.1 | 50.41,39.39 50.41,36.84 EC5.1 | 50.41,39.39 44.39,39.39 ENC.24
N$24
  Top 0.203: ENC.23 44.39,38.68 45.21,38.68 49.8,34.09 50.31,34.09 EC4.1 50.31,34.19 51.13,35 51.13,37.25 54.8,40.92 54.8,41.94 Q2.2
RAW_IV  (via drill 0.35)
  Top 0.254: OD1.C 16.94,92.56 8.88,92.56 6.84,90.52 XO.1 6.74,90.42 6.74,88.38 4.39,86.03 4.39,82.86 6.84,80.42 XO.3 6.84,80.21 7.81,79.24 | 7.81,79.24 8.88,78.17 16.94,78.17 OD2.C | OD3.C 17.25,65.41 12.35,65.41 7.65,70.11 6.84,70.11 XO.5 6.74,70.21 4.39,72.56 4.39,75.82 7.76,79.19 7.81,79.24 | 24.08,32.04 24.08,35.21 C4.+ | 24.08,32.04 24.08,30 20,25.92 20,14.39 22.25,12.14 22.25,11.53 IC1.1 22.45,11.43 22.45,10.92 23.27,10.1 v23.27,9.8 | v51.33,4.49 54.19,4.49 PF1.2 | v23.98,32.04 24.08,32.04
  Bottom 0.254: v51.33,4.49 49.39,2.55 47.86,2.55 47.35,3.06 37.45,3.06 37.04,2.65 30.41,2.65 v23.27,9.8 | v23.98,32.04 9.29,32.04 | 9.29,32.04 7.14,32.04 XI.1 | XO.5 6.84,70.11 6.84,68.07 9.29,65.62 9.29,32.15 9.29,32.04
RD+  (via drill 0.35)
  Top 0.203: v64.19,32.86 59.49,32.86 58.88,32.25 56.02,32.25 ER4.2 | ENC.13 37.15,34.09 41.74,34.09 48.47,27.35 66.84,27.35 70.01,30.51 70.01,32.35 68.99,33.37 U$2.RD+
  Bottom 0.203: v64.19,32.86 65.72,32.86 66.23,33.37 68.88,33.37 U$2.RD+
RD-  (via drill 0.35)
  Top 0.203: v61.43,32.15 60.31,32.15 ER3.2 | v42.55,34.8 37.15,34.8 ENC.12
  Bottom 0.203: U$2.RD- 66.44,37.15 v61.43,32.15 61.03,31.74 46.43,31.74 43.37,34.8 v42.55,34.8
RESET  (via drill 0.35)
  Top 0.203: R2.1 46.53,92.36 50.01,92.36 50.11,92.25 S1.4 55.72,92.15 S1.3 55.82,92.25 v57.15,92.25 | v58.48,91.54 59.29,92.36 59.49,92.36 C2.1 | v55.72,70.42 54.8,69.5 U1.29
  Bottom 0.203: v57.15,92.25 57.86,91.54 v58.48,91.54 58.48,80.21 61.23,77.46 61.23,73.48 58.17,70.42 v55.72,70.42
RXI  (via drill 0.35)
  Top 0.203: v54.6,71.33 55.82,71.33 56.43,70.72 56.43,70.11 55.41,69.09 55.41,68.88 U1.30 | v36.43,53.17 12.04,53.17 11.53,52.66 PP.4
  Bottom 0.203: v36.43,53.17 v54.6,71.33
TD+
  Top 0.203: 67.91,32.09 68.88,31.12 68.88,30.92 U$2.TD+ | 67.91,32.09 66.84,33.17 65.52,33.17 62.86,35.82 60.31,35.82 ER2.1 | ENC.17 44.29,34.8 43.58,34.8 43.27,34.49 43.27,33.17 48.68,27.76 63.58,27.76 67.86,32.04 67.91,32.09
TD-
  Top 0.203: U$2.TD- 66.33,32.15 65.92,32.15 64.5,33.57 61.03,33.57 58.78,35.82 56.02,35.82 ER1.1 55.92,35.82 55.92,33.78 52.66,30.51 51.64,30.51 51.43,30.72 51.43,31.94 50.92,32.45 50.41,32.45 48.68,34.19 44.39,34.19 ENC.16
TXO  (via drill 0.35)
  Top 0.203: v57.45,66.74 57.45,68.07 56.74,68.78 56.64,68.78 56.23,68.37 55.92,68.37 U1.31 | v31.23,47.86 13.68,47.86 11.53,50.01 PP.3
  Bottom 0.203: v57.45,66.74 44.09,53.37 44.09,41.84 38.78,36.53 36.23,36.53 31.23,41.53 v31.23,47.86

### Text on the board
tPlace: IOTECH © 2018 | IOTB v0.6 TOP | S/N: | www.iotech.com.tr
bPlace: IOTECH | IOTB BOT